# Altium project DisplayerPlus.PrjPcb
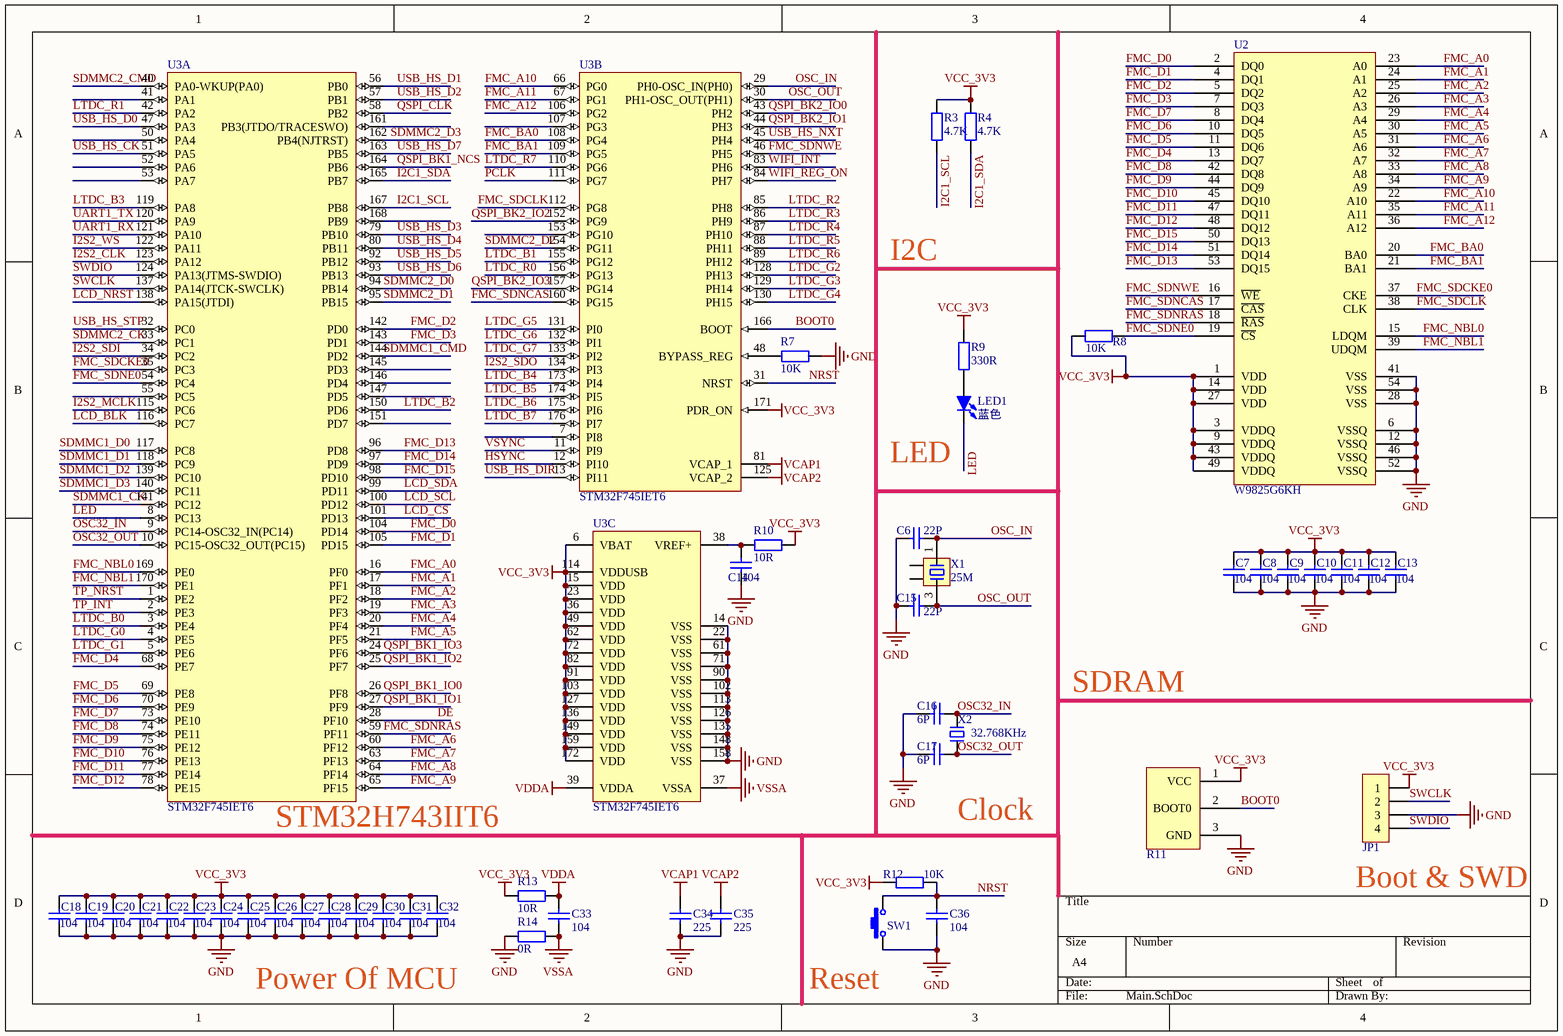
[diagram p0: Main.SchDoc]
4 sheets, 137 parts. Net scope: global (net labels, ports and power ports of the same name join across sheets).
Board file: PCB.PcbDoc
Sheets:
  Main.SchDoc
  Modules.SchDoc
  LCD.SchDoc
  Audio.SchDoc

## Sheet Main.SchDoc
size A4

### Parts
C6  22P  [C0402_M]
C7  104  [C0402_M]
C8  104  [C0402_M]
C9  104  [C0402_M]
C10  104  [C0402_M]
C11  104  [C0402_M]
C12  104  [C0402_M]
C13  104  [C0402_M]
C14  104  [C0402_M]
C15  22P  [C0402_M]
C16  6P  [C0402_M]
C17  6P  [C0402_M]
C18  104  [C0402_M]
C19  104  [C0402_M]
C20  104  [C0402_M]
C21  104  [C0402_M]
C22  104  [C0402_M]
C23  104  [C0402_M]
C24  104  [C0402_M]
C25  104  [C0402_M]
C26  104  [C0402_M]
C27  104  [C0402_M]
C28  104  [C0402_M]
C29  104  [C0402_M]
C30  104  [C0402_M]
C31  104  [C0402_M]
C32  104  [C0402_M]
C33  104  [C0402_M]
C34  225  [C0402_M]
C35  225  [C0402_M]
C36  104  [C0402_M]
JP1  HDR-1X4  [HDR2.54-WS-4P]  (value not drawn)
LED1  蓝色  [LED0603_B]
R3  4.7K  [R0402_M]
R4  4.7K  [R0402_M]
R7  10K  [R0402_M]
R8  10K  [R0402_M]
R9  330R  [R0402_M]
R10  10R  [R0402_M]
R11  BOOT0_0603  [BOOT0_0603]  (value not drawn)
R12  10K  [R0402_M]
R13  10R  [R0402_M]
R14  0R  [R0402_M]
SW1  3x6x5  [SW SMD-3*6*2.5]  (value not drawn)
U2  W9825G6KH  [TSOP-54]
U3  STM32F745IET6  [STM-LQFP176_M]  (parts A,B,C of 3)
X1  25M  [XTAL-3225-4P]
X2  32.768KHz  [OSC-3215-2P]

### Nets
GND: C6.1 C7.1 C8.1 C9.1 C10.1 C11.1 C12.1 C13.1 C14.1 C15.1 C16.2 C17.2 C18.1 C19.1 C20.1 C21.1 C22.1 C23.1 C24.1 C25.1 C26.1 C27.1 C28.1 C29.1 C30.1 C31.1 C32.1 C34.1 C35.1 C36.1 JP1.3 R7.1 R11.3(GND) R14.1 SW1.1 U2.6(VSSQ) U2.12(VSSQ) U2.28(VSS) U2.41(VSS) U2.46(VSSQ) U2.52(VSSQ) U2.54(VSS) U3.14(VSS) U3.22(VSS) U3.61(VSS) U3.71(VSS) U3.90(VSS) U3.102(VSS) U3.113(VSS) U3.126(VSS) U3.135(VSS) U3.148(VSS) U3.158(VSS)
VCAP1: C34.2 U3.81(VCAP_1)
VCAP2: C35.2 U3.125(VCAP_2)
VCC_3V3: C7.2 C8.2 C9.2 C10.2 C11.2 C12.2 C13.2 C18.2 C19.2 C20.2 C21.2 C22.2 C23.2 C24.2 C25.2 C26.2 C27.2 C28.2 C29.2 C30.2 C31.2 C32.2 JP1.1 R3.1 R4.1 R8.2 R9.1 R10.1 R11.1(VCC) R12.1 R13.1 U2.1(VDD) U2.3(VDDQ) U2.9(VDDQ) U2.14(VDD) U2.27(VDD) U2.43(VDDQ) U2.49(VDDQ) U3.6(VBAT) U3.15(VDD) U3.23(VDD) U3.36(VDD) U3.49(VDD) U3.62(VDD) U3.72(VDD) U3.82(VDD) U3.91(VDD) U3.103(VDD) U3.114(VDDUSB) U3.127(VDD) U3.136(VDD) U3.149(VDD) U3.159(VDD) U3.171(PDR_ON) U3.172(VDD)
VDDA: C33.2 R13.2 U3.39(VDDA)
VSSA: C33.1 R14.2 U3.37(VSSA)
BOOT0: R11.2(BOOT0) U3.166(BOOT)
DE: U3.28(PF10)
FMC_A0: U2.23(A0) U3.16(PF0)
FMC_A1: U2.24(A1) U3.17(PF1)
FMC_A2: U2.25(A2) U3.18(PF2)
FMC_A3: U2.26(A3) U3.19(PF3)
FMC_A4: U2.29(A4) U3.20(PF4)
FMC_A5: U2.30(A5) U3.21(PF5)
FMC_A6: U2.31(A6) U3.60(PF12)
FMC_A7: U2.32(A7) U3.63(PF13)
FMC_A8: U2.33(A8) U3.64(PF14)
FMC_A9: U2.34(A9) U3.65(PF15)
FMC_A10: U2.22(A10) U3.66(PG0)
FMC_A11: U2.35(A11) U3.67(PG1)
FMC_A12: U2.36(A12) U3.106(PG2)
FMC_BA0: U2.20(BA0) U3.108(PG4)
FMC_BA1: U2.21(BA1) U3.109(PG5)
FMC_D0: U2.2(DQ0) U3.104(PD14)
FMC_D1: U2.4(DQ1) U3.105(PD15)
FMC_D2: U2.5(DQ2) U3.142(PD0)
FMC_D3: U2.7(DQ3) U3.143(PD1)
FMC_D4: U2.13(DQ7) U3.68(PE7)
FMC_D5: U2.11(DQ6) U3.69(PE8)
FMC_D6: U2.10(DQ5) U3.70(PE9)
FMC_D7: U2.8(DQ4) U3.73(PE10)
FMC_D8: U2.42(DQ8) U3.74(PE11)
FMC_D9: U2.44(DQ9) U3.75(PE12)
FMC_D10: U2.45(DQ10) U3.76(PE13)
FMC_D11: U2.47(DQ11) U3.77(PE14)
FMC_D12: U2.48(DQ12) U3.78(PE15)
FMC_D13: U2.53(DQ15) U3.96(PD8)
FMC_D14: U2.51(DQ14) U3.97(PD9)
FMC_D15: U2.50(DQ13) U3.98(PD10)
FMC_NBL0: U2.15(LDQM) U3.169(PE0)
FMC_NBL1: U2.39(UDQM) U3.170(PE1)
FMC_SDCKE0: U2.37(CKE) U3.35(PC3)
FMC_SDCLK: U2.38(CLK) U3.112(PG8)
FMC_SDNCAS: U2.17(~{CAS}) U3.160(PG15)
FMC_SDNE0: R8.1 U2.19(~{CS}) U3.54(PC4)
FMC_SDNRAS: U2.18(~{RAS}) U3.59(PF11)
FMC_SDNWE: U2.16(~{WE}) U3.46(PH5)
HSYNC: U3.12(PI10)
I2C1_SCL: R3.2 U3.167(PB8)
I2C1_SDA: R4.2 U3.165(PB7)
I2S2_CLK: U3.123(PA12)
I2S2_MCLK: U3.115(PC6)
I2S2_SDI: U3.34(PC2)
I2S2_SDO: U3.134(PI3)
I2S2_WS: U3.122(PA11)
LCD_BLK: U3.116(PC7)
LCD_CS: U3.101(PD13)
LCD_NRST: U3.138(PA15(JTDI))
LCD_SCL: U3.100(PD12)
LCD_SDA: U3.99(PD11)
LED: LED1.2(K) U3.8(PC13)
LTDC_B0: U3.3(PE4)
LTDC_B1: U3.155(PG12)
LTDC_B2: U3.150(PD6)
LTDC_B3: U3.119(PA8)
LTDC_B4: U3.173(PI4)
LTDC_B5: U3.174(PI5)
LTDC_B6: U3.175(PI6)
LTDC_B7: U3.176(PI7)
LTDC_G0: U3.4(PE5)
LTDC_G1: U3.5(PE6)
LTDC_G2: U3.128(PH13)
LTDC_G3: U3.129(PH14)
LTDC_G4: U3.130(PH15)
LTDC_G5: U3.131(PI0)
LTDC_G6: U3.132(PI1)
LTDC_G7: U3.133(PI2)
LTDC_R0: U3.156(PG13)
LTDC_R1: U3.42(PA2)
LTDC_R2: U3.85(PH8)
LTDC_R3: U3.86(PH9)
LTDC_R4: U3.87(PH10)
LTDC_R5: U3.88(PH11)
LTDC_R6: U3.89(PH12)
LTDC_R7: U3.110(PG6)
NRST: C36.2 R12.2 SW1.2 U3.31(NRST)
OSC32_IN: C16.1 U3.9(PC14-OSC32_IN(PC14)) X2.1
OSC32_OUT: C17.1 U3.10(PC15-OSC32_OUT(PC15)) X2.2
OSC_IN: C6.2 U3.29(PH0-OSC_IN(PH0)) X1.1
OSC_OUT: C15.2 U3.30(PH1-OSC_OUT(PH1)) X1.3
PCLK: U3.111(PG7)
QSPI_BK1_IO0: U3.26(PF8)
QSPI_BK1_IO1: U3.27(PF9)
QSPI_BK1_IO2: U3.25(PF7)
QSPI_BK1_IO3: U3.24(PF6)
QSPI_BK1_NCS: U3.164(PB6)
QSPI_BK2_IO0: U3.43(PH2)
QSPI_BK2_IO1: U3.44(PH3)
QSPI_BK2_IO2: U3.152(PG9)
QSPI_BK2_IO3: U3.157(PG14)
QSPI_CLK: U3.58(PB2)
SDMMC1_CK: U3.141(PC12)
SDMMC1_CMD: U3.144(PD2)
SDMMC1_D0: U3.117(PC8)
SDMMC1_D1: U3.118(PC9)
SDMMC1_D2: U3.139(PC10)
SDMMC1_D3: U3.140(PC11)
SDMMC2_CK: U3.33(PC1)
SDMMC2_CMD: U3.40(PA0-WKUP(PA0))
SDMMC2_D0: U3.94(PB14)
SDMMC2_D1: U3.95(PB15)
SDMMC2_D2: U3.154(PG11)
SDMMC2_D3: U3.162(PB4(NJTRST))
SWCLK: JP1.2 U3.137(PA14(JTCK-SWCLK))
SWDIO: JP1.4 U3.124(PA13(JTMS-SWDIO))
TP_INT: U3.2(PE3)
TP_NRST: U3.1(PE2)
UART1_RX: U3.121(PA10)
UART1_TX: U3.120(PA9)
USB_HS_CK: U3.51(PA5)
USB_HS_D0: U3.47(PA3)
USB_HS_D1: U3.56(PB0)
USB_HS_D2: U3.57(PB1)
USB_HS_D3: U3.79(PB10)
USB_HS_D4: U3.80(PB11)
USB_HS_D5: U3.92(PB12)
USB_HS_D6: U3.93(PB13)
USB_HS_D7: U3.163(PB5)
USB_HS_DIR: U3.13(PI11)
USB_HS_NXT: U3.45(PH4)
USB_HS_STP: U3.32(PC0)
VSYNC: U3.11(PI9)
WIFI_INT: U3.83(PH6)
WIFI_REG_ON: U3.84(PH7)
NetC14_2: C14.2 R10.2 U3.38(VREF+)
NetLED1_1: LED1.1(A) R9.2
NetR7_2: R7.2 U3.48(BYPASS_REG)

Not connected (* = marked no-connect by the designer): U3 7(PI8) 41(PA1) 50(PA4) 52(PA6) 53(PA7) 55(PC5) 107(PG3) 145(PD3) 146(PD4) 147(PD5) 151(PD7) 153(PG10) 161(PB3(JTDO/TRACESWO)) 168(PB9); X1 2 4

### Notes on the sheet
- I2C
- (near LED1) LED
- SDRAM
- (near U3) STM32H743IIT6
- Clock
- (near JP1) Boot & SWD
- Power Of MCU
- (near SW1) Reset

### Library data of the parts
C6-C36 = C: 贴片电容/MLCC电容; BOM名称: 无极性贴片电容; 联系卖家，免费查找封装: 唯一出售店铺网址https://shop463601444.taobao.com
JP1 = Header 4: 4P接插件; 以赠品形式获赠本封装库的买家，还可联系卖家免费指导AD软件使用: 联系卖家 免费技术支持; 联系卖家，免费查找封装: 唯一出售店铺网址https://shop463601444.taobao.com
LED1 = LED-SMD: 贴片LED; 封装库来自淘宝卖家ID：黄晶宝石: 其他店铺购入均为盗版封装库，请立即申请退款，本店现金奖励20~200元; BOM名称: 贴片LED
R3 R4 R7-R10 R12-R14 = R: 贴片电阻; 联系卖家，免费查找封装: 唯一出售店铺网址https://shop463601444.taobao.com; BOM名称: 贴片电阻
SW1 = SW 3x6: 3x6轻触开关; 联系卖家，免费查找封装: 唯一出售店铺网址https://shop463601444.taobao.com; 封装库来自淘宝卖家ID：黄晶宝石: 其他店铺购入的，请立即申请退款，本店现金奖励20~500元; BOM名称: 3x6轻触开关
U2 = W9825G6KH: SDRAM 易失性动态存储器
U3 = STM32F745IET6: ARM-Based Cortex-M7 32 Bit MCU+FPU, 462 DMIPS, 512 kB Flash, 320 kB RAM, 140 I/Os, -40 to 85 degC, 176-Pin LQFP, Halogen-Free, Tray; Clock Frequency Max: 216 MHz; L1 Cache Instruction Memory: 4 KByte; Data RAM Size: 320 KByte; Program Memory Size: 512 KByte; Supply Voltage Max: 3.6 V; Supply Voltage Min: 1.7 V; Number of I/Os: 140; DatasheetVersion: Rev. 1; ComponentLink3Description: Package Specification; Temperature Min: -40 degC; Packing: Tray; ComponentLink2URL: http://www.st.com/st-web-ui/static/active/en/resource/technical/document/datasheet/DM00166116.pdf; ComponentLink1Description: Manufacturer URL; Temperature Max: 85 degC; ComponentLink1URL: http://www.st.com/web/en/home.html; Mounting Technology: Surface Mount; ComponentLink2Description: Datasheet; ComponentLink3URL: http://www.st.com/st-web-ui/static/active/en/resource/technical/document/datasheet/DM00035129.pdf; PartNumber: STM32F745IE; PackageDescription: 176-Pin Low Profile Quad Flat Package, 24 x 24 mm Body, 0.5 mm Pitch; L1 Cache Data Memory: 4 KByte
X1 = XTAL-4P: 4脚无源晶振(谐振器）; 联系卖家，免费查找封装: 唯一出售店铺网址https://shop463601444.taobao.com; BOM名称: 4脚无源晶振(谐振器）
X2 = XTAL-2P: 2脚无源脚晶振; 版权归属: 源创客; BOM名称: 2脚无源脚晶振; 学习资源: www.ooocke.com

## Sheet Modules.SchDoc
size A4
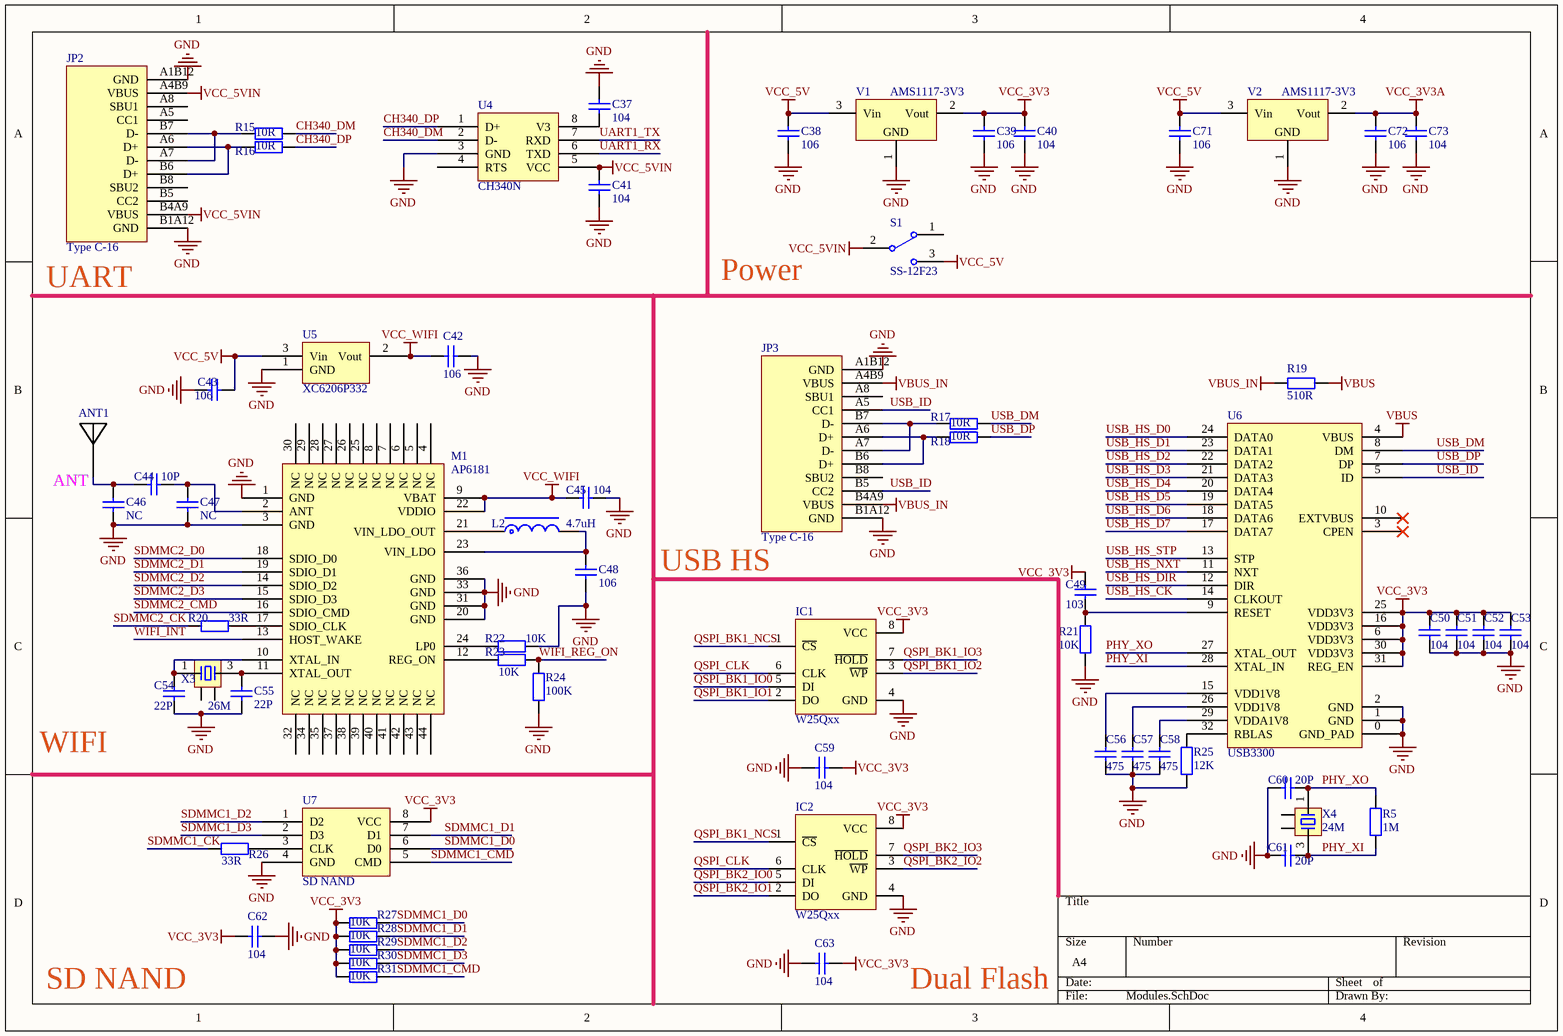
[diagram p1: Modules.SchDoc]

### Parts
ANT1  ANT_SMD  [2.4G ANT]  (value not drawn)
C37  104  [C0402_M]
C38  106  [C1206_M]
C39  106  [C0402_M]
C40  104  [C0402_M]
C41  104  [C0402_M]
C42  106  [C0402_M]
C43  106  [C0402_M]
C44  10P  [C0402_M]
C45  104  [C0402_M]
C46  NC  [C0402_M]
C47  NC  [C0402_M]
C48  106  [C0402_M]
C49  103  [C0402_M]
C50  104  [C0402_M]
C51  104  [C0402_M]
C52  104  [C0402_M]
C53  104  [C0402_M]
C54  22P  [C0402_M]
C55  22P  [C0402_M]
C56  475  [C0402_M]
C57  475  [C0402_M]
C58  475  [C0402_M]
C59  104  [C0402_M]
C60  20P  [C0402_M]
C61  20P  [C0402_M]
C62  104  [C0402_M]
C63  104  [C0402_M]
C71  106  [C1206_M]
C72  106  [C0402_M]
C73  104  [C0402_M]
IC1  W25Qxx  [SOP8W_N]
IC2  W25Qxx  [SOP8W_N]
JP2  Type C-16  [TypeC16]
JP3  Type C-16  [TypeC16]
L2  4.7uH  [L1210]
M1  AP6181  [AP6181]
R5  1M  [R0402_M]
R15  10R  [R0402_M]
R16  10R  [R0402_M]
R17  10R  [R0402_M]
R18  10R  [R0402_M]
R19  510R  [R0603_M]
R20  33R  [R0402_M]
R21  10K  [R0402_M]
R22  10K  [R0402_M]
R23  10K  [R0402_M]
R24  100K  [R0402_M]
R25  12K  [R0402_M]
R26  33R  [R0402_M]
R27  10K  [R0402_M]
R28  10K  [R0402_M]
R29  10K  [R0402_M]
R30  10K  [R0402_M]
R31  10K  [R0402_M]
S1  SS-12F23  [MSK-12C01-07]
U4  CH340N  [SOP8]
U5  XC6206P332  [SOT23-3N]
U6  USB3300  [QFN32 5x5_M]
U7  SD NAND  [LGA8 6x8mm]
V1  AMS1117-3V3  [SOT89_N]
V2  AMS1117-3V3  [SOT89_N]
X3  26M  [XTAL-3225-4P]
X4  24M  [XTAL-3225-4P]

### Nets
GND: C37.2 C38.1 C39.1 C40.1 C41.1 C42.1 C43.2 C45.1 C46.2 C47.2 C48.1 C50.1 C51.1 C52.1 C53.1 C54.1 C55.1 C56.1 C57.1 C58.1 C59.1 C60.1 C61.1 C62.1 C63.1 C71.1 C72.1 C73.1 IC1.4(GND) IC2.4(GND) JP2.A1B12(GND) JP2.B1A12(GND) JP3.A1B12(GND) JP3.B1A12(GND) M1.1(GND) M1.3(GND) M1.20(GND) M1.31(GND) M1.33(GND) M1.36(GND) R21.1 R22.1 R24.2 R25.2 U4.3(GND) U5.1(GND) U6.0(GND_PAD) U6.1(GND) U6.2(GND) U7.4(GND) V1.1(GND) V2.1(GND)
VBUS: R19.1 U6.4(VBUS)
VBUS_IN: JP3.A4B9(VBUS) JP3.B4A9(VBUS) R19.2
VCC_3V3: C39.2 C40.2 C49.2 C50.2 C51.2 C52.2 C53.2 C59.2 C62.2 C63.2 IC1.8(VCC) IC2.8(VCC) R27.2 R28.2 R29.2 R30.2 R31.2 U6.6(VDD3V3) U6.16(VDD3V3) U6.25(VDD3V3) U6.30(VDD3V3) U6.31(REG_EN) U7.8(VCC) V1.2(Vout)
VCC_3V3A: C72.2 C73.2 V2.2(Vout)
VCC_5V: C38.2 C43.1 C71.2 S1.3 U5.3(Vin) V1.3(Vin) V2.3(Vin)
VCC_5VIN: C41.2 JP2.A4B9(VBUS) JP2.B4A9(VBUS) S1.2 U4.5(VCC)
VCC_WIFI: C42.2 C45.2 M1.9(VBAT) M1.22(VDDIO) U5.2(Vout)
CH340_DM: R15.1 U4.2(D-)
CH340_DP: R16.1 U4.1(D+)
PHY_XI: C61.2 R5.1 U6.28(XTAL_IN) X4.3
PHY_XO: C60.2 R5.2 U6.27(XTAL_OUT) X4.1
QSPI_BK1_IO0: IC1.5(DI)
QSPI_BK1_IO1: IC1.2(DO)
QSPI_BK1_IO2: IC1.3(~{WP})
QSPI_BK1_IO3: IC1.7(~{HOLD})
QSPI_BK1_NCS: IC1.1(~{CS}) IC2.1(~{CS})
QSPI_BK2_IO0: IC2.5(DI)
QSPI_BK2_IO1: IC2.2(DO)
QSPI_BK2_IO2: IC2.3(~{WP})
QSPI_BK2_IO3: IC2.7(~{HOLD})
QSPI_CLK: IC1.6(CLK) IC2.6(CLK)
SDMMC1_CK: R26.2
SDMMC1_CMD: R31.1 U7.5(CMD)
SDMMC1_D0: R27.1 U7.6(D0)
SDMMC1_D1: R28.1 U7.7(D1)
SDMMC1_D2: R29.1 U7.1(D2)
SDMMC1_D3: R30.1 U7.2(D3)
SDMMC2_CK: R20.2
SDMMC2_CMD: M1.16(SDIO_CMD)
SDMMC2_D0: M1.18(SDIO_D0)
SDMMC2_D1: M1.19(SDIO_D1)
SDMMC2_D2: M1.14(SDIO_D2)
SDMMC2_D3: M1.15(SDIO_D3)
UART1_RX: U4.6(TXD)
UART1_TX: U4.7(RXD)
USB_DM: R17.1 U6.8(DM)
USB_DP: R18.1 U6.7(DP)
USB_HS_CK: U6.14(CLKOUT)
USB_HS_D0: U6.24(DATA0)
USB_HS_D1: U6.23(DATA1)
USB_HS_D2: U6.22(DATA2)
USB_HS_D3: U6.21(DATA3)
USB_HS_D4: U6.20(DATA4)
USB_HS_D5: U6.19(DATA5)
USB_HS_D6: U6.18(DATA6)
USB_HS_D7: U6.17(DATA7)
USB_HS_DIR: U6.12(DIR)
USB_HS_NXT: U6.11(NXT)
USB_HS_STP: U6.13(STP)
USB_ID: JP3.A5(CC1) JP3.B5(CC2) U6.5(ID)
WIFI_INT: M1.13(HOST_WAKE)
WIFI_REG_ON: R23.1 R24.1
NetANT1_1: ANT1.1 C44.2 C46.1
NetC37_1: C37.1 U4.8(V3)
NetC44_1: C44.1 C47.1 M1.2(ANT)
NetC48_2: C48.2 L2.2 M1.23(VIN_LDO)
NetC49_1: C49.1 R21.2 U6.9(RESET)
NetC54_2: C54.2 M1.10(XTAL_IN) X3.1
NetC55_2: C55.2 M1.11(XTAL_OUT) X3.3
NetC56_2: C56.2 U6.15(VDD1V8)
NetC57_2: C57.2 U6.26(VDD1V8)
NetC58_2: C58.2 U6.29(VDDA1V8)
NetJP2_A6: JP2.A6(D+) JP2.B6(D+) R16.2
NetJP2_A7: JP2.A7(D-) JP2.B7(D-) R15.2
NetJP3_A6: JP3.A6(D+) JP3.B6(D+) R18.2
NetJP3_A7: JP3.A7(D-) JP3.B7(D-) R17.2
NetL2_1: L2.1 M1.21(VIN_LDO_OUT)
NetM1_12: M1.12(REG_ON) R23.2
NetM1_17: M1.17(SDIO_CLK) R20.1
NetM1_24: M1.24(LP0) R22.2
NetR25_1: R25.1 U6.32(RBLAS)
NetR26_1: R26.1 U7.3(CLK)

Not connected (* = marked no-connect by the designer): JP2 A5(CC1) A8(SBU1) B5(CC2) B8(SBU2); JP3 A8(SBU1) B8(SBU2); M1 4(NC) 5(NC) 6(NC) 7(NC) 8(NC) 25(NC) 26(NC) 27(NC) 28(NC) 29(NC) 30(NC) 32(NC) 34(NC) 35(NC) 37(NC) 38(NC) 39(NC) 40(NC) 41(NC) 42(NC) 43(NC) 44(NC); S1 1; U4 4(RTS); U6 3(CPEN)* 10(EXTVBUS)*; X3 2 4; X4 2 4

### Notes on the sheet
- (near JP2) UART
- Power
- ANT
- USB HS
- WIFI
- SD NAND
- Dual Flash

### Library data of the parts
C37-C63 C71-C73 = C: as C6 on sheet Main
IC1 IC2 = W25Q: SPI Flash; BOM名称: 外置Flash; 版权归属: 封装库来自淘宝 ID：黄晶宝石; 学习资源: https://shop463601444.taobao.com
L2 = L-NR: 太诱-NR磁胶电感; BOM名称: NR磁胶电感; 联系卖家，免费查找封装: 唯一出售店铺网址https://shop463601444.taobao.com
M1 = AP6181: SDIO WIFI模块
R5 R15-R31 = R: as R3 on sheet Main; BOM名称: 贴片电阻
S1 = SSW-1P: 1路波动开关; BOM名称: 波动开关; 联系卖家，免费查找封装: 唯一出售店铺网址https://shop463601444.taobao.com; 封装库来自淘宝卖家ID：黄晶宝石: 其他店铺购入的，请立即申请退款，本店现金奖励20~500元
U4 = CH340N: USB转UART芯片 8P
U5 = XC6206P332: 低压差LDO
U6 = USB3300: USB2.0 HS PHY; pin to pad: 0>33
U7 = SD NAND: 贴片式SD
V1 V2 = AMS1117_SOT89: 三端稳压芯片; BOM名称: 稳压芯片; 封装库来自淘宝卖家ID：黄晶宝石: 其他店铺购入的买家，请立即申请退款，本店现金奖励20~1000元
X3 X4 = XTAL-4P: as X1 on sheet Main; BOM名称: 4脚无源晶振(谐振器）

## Sheet LCD.SchDoc
size A4
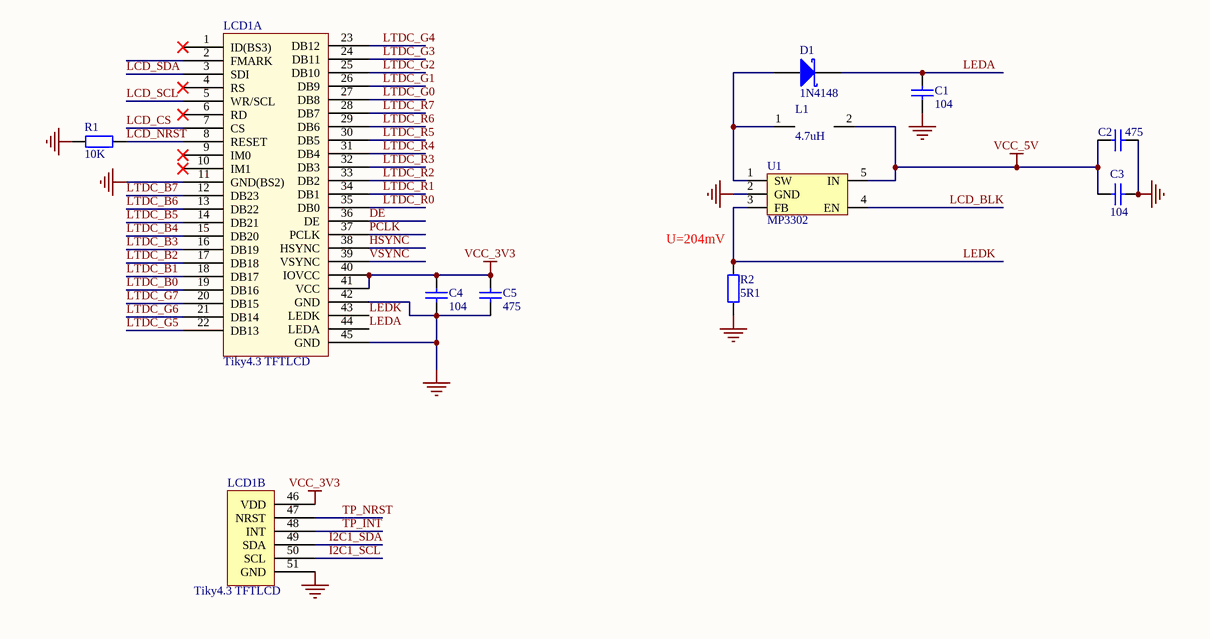
[diagram p2: LCD.SchDoc]

### Parts
C1  104  [C0402_M]
C2  475  [C0402_M]
C3  104  [C0402_M]
C4  104  [C0402_M]
C5  475  [C0402_M]
D1  1N4148  [SOD-123]
L1  4.7uH  [L1206]
LCD1  Tiky4.3 TFTLCD  [Tiky 4.3 TFTLCD]  (parts A,B of 2)
R1  10K  [R0402_M]
R2  5R1  [R0603_M]
U1  MP3302  [SOT23-5]

### Nets
GND: C1.2 C2.1 C3.2 C4.2 C5.2 LCD1.11(GND(BS2)) LCD1.42(GND) LCD1.45(GND) LCD1.51(GND) R1.1 R2.2 U1.2(GND)
VCC_3V3: C4.1 C5.1 LCD1.40(IOVCC) LCD1.41(VCC) LCD1.46(VDD)
VCC_5V: C2.2 C3.1 L1.2 U1.5(IN)
DE: LCD1.36(DE)
HSYNC: LCD1.38(HSYNC)
I2C1_SCL: LCD1.50(SCL)
I2C1_SDA: LCD1.49(SDA)
LCD_BLK: U1.4(EN)
LCD_CS: LCD1.7(CS)
LCD_NRST: LCD1.8(RESET) R1.2
LCD_SCL: LCD1.5(WR/SCL)
LCD_SDA: LCD1.3(SDI)
LEDA: C1.1 D1.2(K) LCD1.44(LEDA)
LEDK: LCD1.43(LEDK) R2.1 U1.3(FB)
LTDC_B0: LCD1.19(DB16)
LTDC_B1: LCD1.18(DB17)
LTDC_B2: LCD1.17(DB18)
LTDC_B3: LCD1.16(DB19)
LTDC_B4: LCD1.15(DB20)
LTDC_B5: LCD1.14(DB21)
LTDC_B6: LCD1.13(DB22)
LTDC_B7: LCD1.12(DB23)
LTDC_G0: LCD1.27(DB8)
LTDC_G1: LCD1.26(DB9)
LTDC_G2: LCD1.25(DB10)
LTDC_G3: LCD1.24(DB11)
LTDC_G4: LCD1.23(DB12)
LTDC_G5: LCD1.22(DB13)
LTDC_G6: LCD1.21(DB14)
LTDC_G7: LCD1.20(DB15)
LTDC_R0: LCD1.35(DB0)
LTDC_R1: LCD1.34(DB1)
LTDC_R2: LCD1.33(DB2)
LTDC_R3: LCD1.32(DB3)
LTDC_R4: LCD1.31(DB4)
LTDC_R5: LCD1.30(DB5)
LTDC_R6: LCD1.29(DB6)
LTDC_R7: LCD1.28(DB7)
PCLK: LCD1.37(PCLK)
TP_INT: LCD1.48(INT)
TP_NRST: LCD1.47(NRST)
VSYNC: LCD1.39(VSYNC)
NetD1_1: D1.1(A) L1.1 U1.1(SW)

Not connected (* = marked no-connect by the designer): LCD1 1(ID(BS3))* 2(FMARK) 4(RS)* 6(RD)* 9(IM0)* 10(IM1)*

### Notes on the sheet
- (near R2) U=204mV

### Library data of the parts
C1-C5 = C: as C6 on sheet Main
D1 = D Schottky: Schottky Diode; Published: 8-Jun-2000; LatestRevisionDate: 17-Jul-2002; LatestRevisionNote: Re-released for DXP Platform.; PackageReference: SMB; Publisher: Altium Limited; PackageDescription: DO-214-AA/SMB; 2 C-Bend Leads; Body 5.3 x 3.6 mm, inc. leads (LxW); Code_JEDEC: DO-214-AA
L1 = Inductor
R1 R2 = R: as R3 on sheet Main; BOM名称: 贴片电阻

## Sheet Audio.SchDoc
size A4
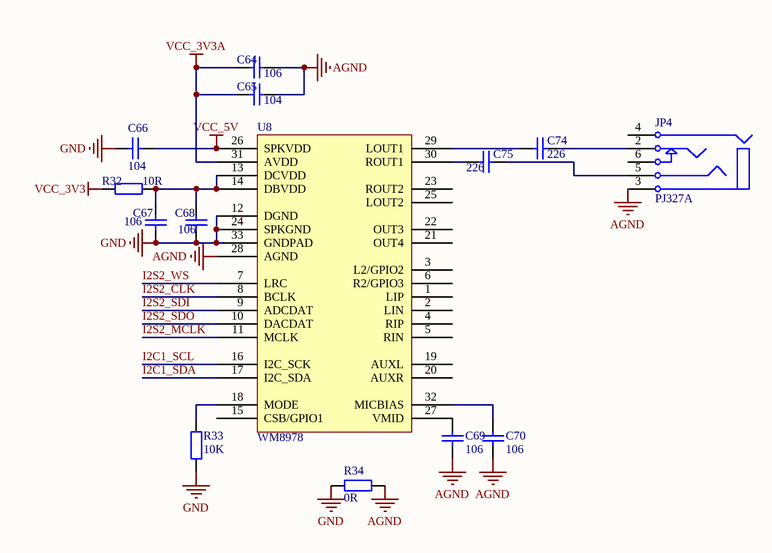
[diagram p3: Audio.SchDoc]

### Parts
C64  106  [C0402_M]
C65  104  [C0402_M]
C66  104  [C0402_M]
C67  106  [C0402_M]
C68  106  [C0402_M]
C69  106  [C0402_M]
C70  106  [C0402_M]
C74  226  [C0805_M]
C75  226  [C0805_M]
JP4  PJ327A  [PJ327A]
R32  10R  [R0603_M]
R33  10K  [R0402_M]
R34  0R  [R0603_M]
U8  WM8978  [QFN32 5x5_N]

### Nets
AGND: C64.1 C65.1 C69.1 C70.1 JP4.3 R34.1 U8.28(AGND)
GND: C66.1 C67.2 C68.2 R33.1 R34.2 U8.12(DGND) U8.24(SPKGND) U8.33(GNDPAD)
VCC_3V3: R32.2
VCC_3V3A: C64.2 C65.2 U8.31(AVDD)
VCC_5V: C66.2 U8.26(SPKVDD)
I2C1_SCL: U8.16(I2C_SCK)
I2C1_SDA: U8.17(I2C_SDA)
I2S2_CLK: U8.8(BCLK)
I2S2_MCLK: U8.11(MCLK)
I2S2_SDI: U8.9(ADCDAT)
I2S2_SDO: U8.10(DACDAT)
I2S2_WS: U8.7(LRC)
NetC67_1: C67.1 C68.1 R32.1 U8.13(DCVDD) U8.14(DBVDD)
NetC69_2: C69.2 U8.27(VMID)
NetC70_2: C70.2 U8.32(MICBIAS)
NetC74_1: C74.1 U8.29(LOUT1)
NetC74_2: C74.2 JP4.2
NetC75_1: C75.1 U8.30(ROUT1)
NetC75_2: C75.2 JP4.5
NetR33_2: R33.2 U8.18(MODE)

Not connected (* = marked no-connect by the designer): JP4 4 6; U8 1(LIP) 2(LIN) 3(L2/GPIO2) 4(RIP) 5(RIN) 6(R2/GPIO3) 15(CSB/GPIO1) 19(AUXL) 20(AUXR) 21(OUT4) 22(OUT3) 23(ROUT2) 25(LOUT2)

### Library data of the parts
C64-C70 C74 C75 = C: as C6 on sheet Main
JP4 = PJ327A: 3.5mm音频接口
R32-R34 = R: as R3 on sheet Main; BOM名称: 贴片电阻

## Nets that join several sheets
GND: Main (53 pins), Modules (52 pins), LCD (12 pins), Audio (8 pins)
VCC_3V3: Main (55 pins), Modules (24 pins), LCD (5 pins), Audio (R32.2)
VCC_3V3A: Modules (C72.2 C73.2 V2.2), Audio (C64.2 C65.2 U8.31)
VCC_5V: Modules (7 pins), LCD (C2.2 C3.1 L1.2 U1.5), Audio (C66.2 U8.26)
DE: Main (U3.28), LCD (LCD1.36)
HSYNC: Main (U3.12), LCD (LCD1.38)
I2C1_SCL: Main (R3.2 U3.167), LCD (LCD1.50), Audio (U8.16)
I2C1_SDA: Main (R4.2 U3.165), LCD (LCD1.49), Audio (U8.17)
I2S2_CLK: Main (U3.123), Audio (U8.8)
I2S2_MCLK: Main (U3.115), Audio (U8.11)
I2S2_SDI: Main (U3.34), Audio (U8.9)
I2S2_SDO: Main (U3.134), Audio (U8.10)
I2S2_WS: Main (U3.122), Audio (U8.7)
LCD_BLK: Main (U3.116), LCD (U1.4)
LCD_CS: Main (U3.101), LCD (LCD1.7)
LCD_NRST: Main (U3.138), LCD (LCD1.8 R1.2)
LCD_SCL: Main (U3.100), LCD (LCD1.5)
LCD_SDA: Main (U3.99), LCD (LCD1.3)
LTDC_B0: Main (U3.3), LCD (LCD1.19)
LTDC_B1: Main (U3.155), LCD (LCD1.18)
LTDC_B2: Main (U3.150), LCD (LCD1.17)
LTDC_B3: Main (U3.119), LCD (LCD1.16)
LTDC_B4: Main (U3.173), LCD (LCD1.15)
LTDC_B5: Main (U3.174), LCD (LCD1.14)
LTDC_B6: Main (U3.175), LCD (LCD1.13)
LTDC_B7: Main (U3.176), LCD (LCD1.12)
LTDC_G0: Main (U3.4), LCD (LCD1.27)
LTDC_G1: Main (U3.5), LCD (LCD1.26)
LTDC_G2: Main (U3.128), LCD (LCD1.25)
LTDC_G3: Main (U3.129), LCD (LCD1.24)
LTDC_G4: Main (U3.130), LCD (LCD1.23)
LTDC_G5: Main (U3.131), LCD (LCD1.22)
LTDC_G6: Main (U3.132), LCD (LCD1.21)
LTDC_G7: Main (U3.133), LCD (LCD1.20)
LTDC_R0: Main (U3.156), LCD (LCD1.35)
LTDC_R1: Main (U3.42), LCD (LCD1.34)
LTDC_R2: Main (U3.85), LCD (LCD1.33)
LTDC_R3: Main (U3.86), LCD (LCD1.32)
LTDC_R4: Main (U3.87), LCD (LCD1.31)
LTDC_R5: Main (U3.88), LCD (LCD1.30)
LTDC_R6: Main (U3.89), LCD (LCD1.29)
LTDC_R7: Main (U3.110), LCD (LCD1.28)
PCLK: Main (U3.111), LCD (LCD1.37)
QSPI_BK1_IO0: Main (U3.26), Modules (IC1.5)
QSPI_BK1_IO1: Main (U3.27), Modules (IC1.2)
QSPI_BK1_IO2: Main (U3.25), Modules (IC1.3)
QSPI_BK1_IO3: Main (U3.24), Modules (IC1.7)
QSPI_BK1_NCS: Main (U3.164), Modules (IC1.1 IC2.1)
QSPI_BK2_IO0: Main (U3.43), Modules (IC2.5)
QSPI_BK2_IO1: Main (U3.44), Modules (IC2.2)
QSPI_BK2_IO2: Main (U3.152), Modules (IC2.3)
QSPI_BK2_IO3: Main (U3.157), Modules (IC2.7)
QSPI_CLK: Main (U3.58), Modules (IC1.6 IC2.6)
SDMMC1_CK: Main (U3.141), Modules (R26.2)
SDMMC1_CMD: Main (U3.144), Modules (R31.1 U7.5)
SDMMC1_D0: Main (U3.117), Modules (R27.1 U7.6)
SDMMC1_D1: Main (U3.118), Modules (R28.1 U7.7)
SDMMC1_D2: Main (U3.139), Modules (R29.1 U7.1)
SDMMC1_D3: Main (U3.140), Modules (R30.1 U7.2)
SDMMC2_CK: Main (U3.33), Modules (R20.2)
SDMMC2_CMD: Main (U3.40), Modules (M1.16)
SDMMC2_D0: Main (U3.94), Modules (M1.18)
SDMMC2_D1: Main (U3.95), Modules (M1.19)
SDMMC2_D2: Main (U3.154), Modules (M1.14)
SDMMC2_D3: Main (U3.162), Modules (M1.15)
TP_INT: Main (U3.2), LCD (LCD1.48)
TP_NRST: Main (U3.1), LCD (LCD1.47)
UART1_RX: Main (U3.121), Modules (U4.6)
UART1_TX: Main (U3.120), Modules (U4.7)
USB_HS_CK: Main (U3.51), Modules (U6.14)
USB_HS_D0: Main (U3.47), Modules (U6.24)
USB_HS_D1: Main (U3.56), Modules (U6.23)
USB_HS_D2: Main (U3.57), Modules (U6.22)
USB_HS_D3: Main (U3.79), Modules (U6.21)
USB_HS_D4: Main (U3.80), Modules (U6.20)
USB_HS_D5: Main (U3.92), Modules (U6.19)
USB_HS_D6: Main (U3.93), Modules (U6.18)
USB_HS_D7: Main (U3.163), Modules (U6.17)
USB_HS_DIR: Main (U3.13), Modules (U6.12)
USB_HS_NXT: Main (U3.45), Modules (U6.11)
USB_HS_STP: Main (U3.32), Modules (U6.13)
VSYNC: Main (U3.11), LCD (LCD1.39)
WIFI_INT: Main (U3.83), Modules (M1.13)
WIFI_REG_ON: Main (U3.84), Modules (R23.1 R24.1)